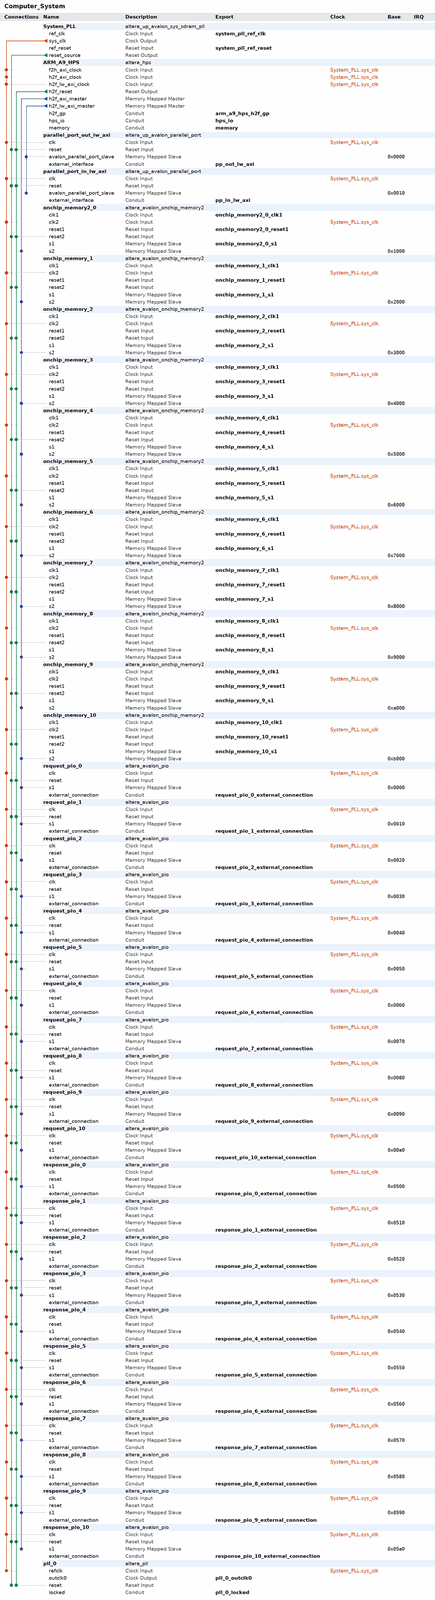
[diagram p0: system contents, whole]
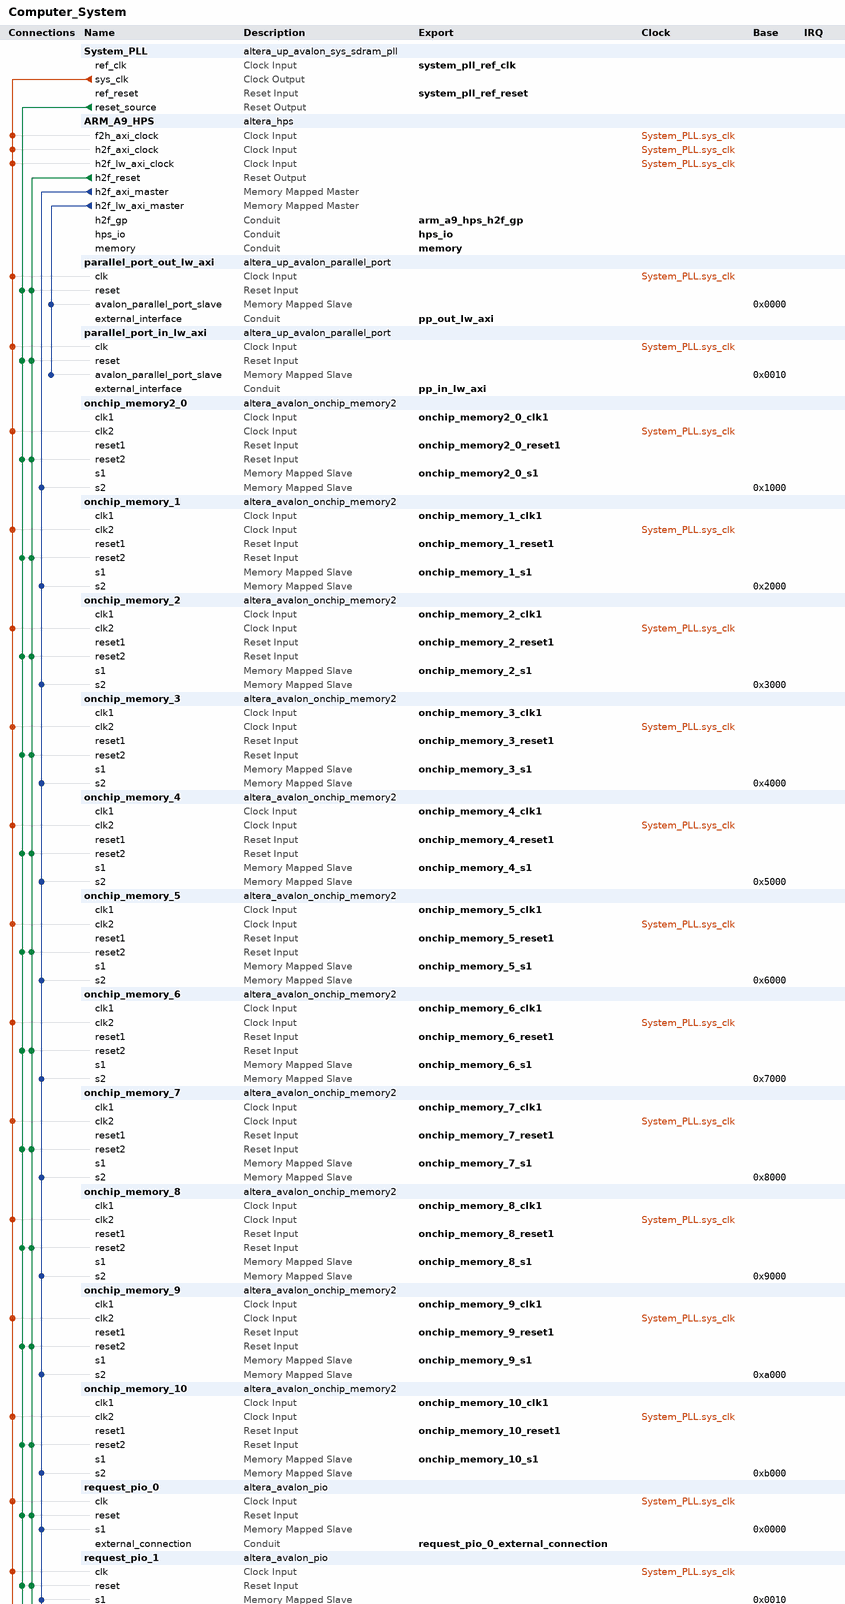
[diagram p1: system contents, upper part]
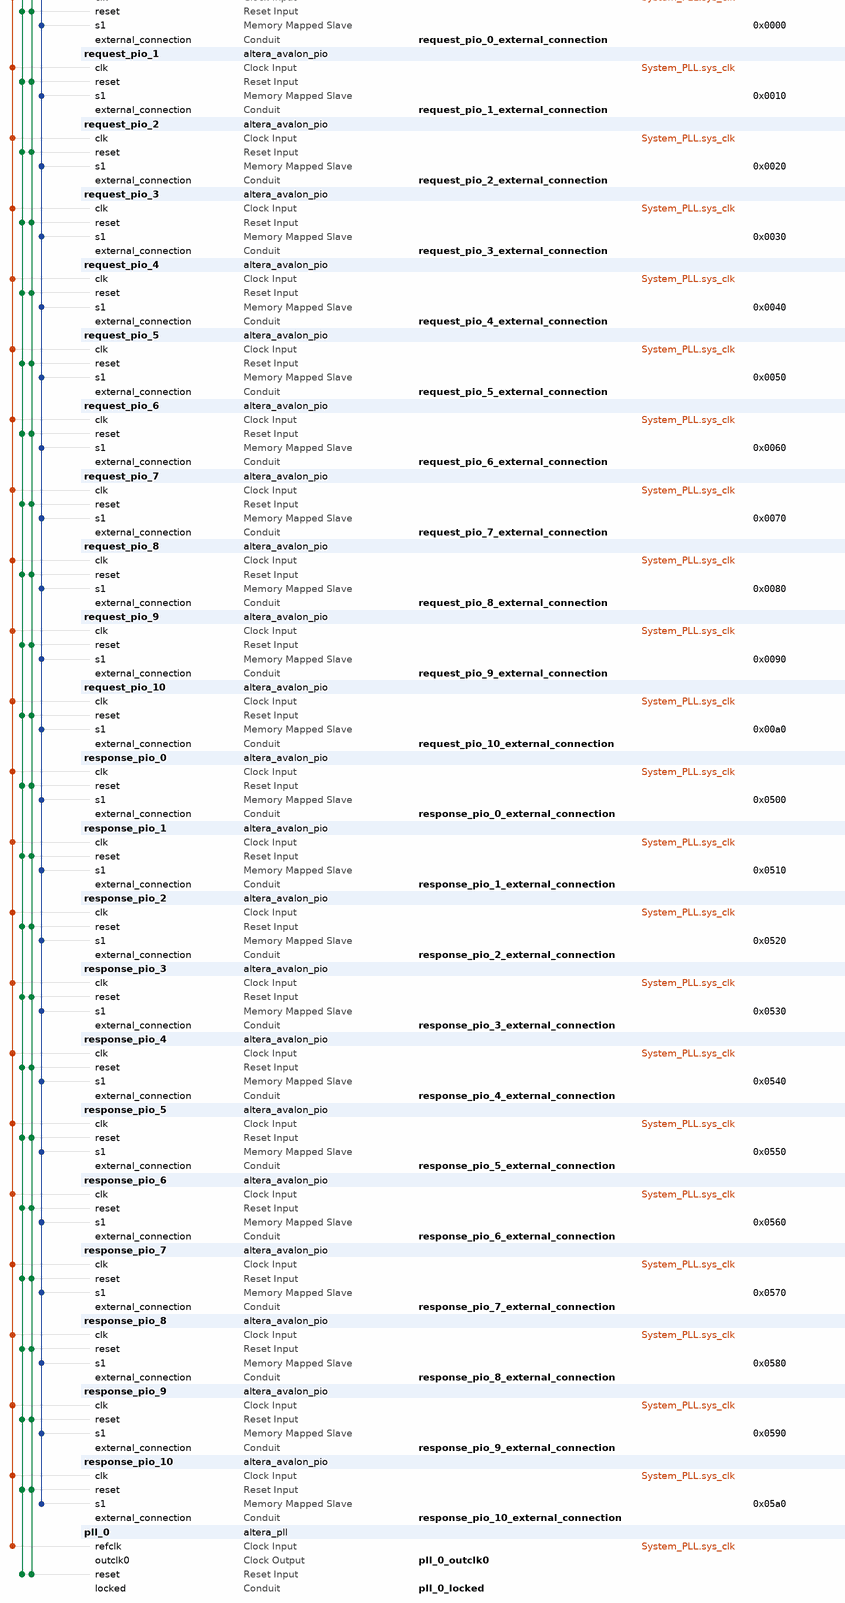
[diagram p2: system contents, lower part]
# Platform Designer (Qsys) system Computer_System, Cyclone V 5CSEMA5F31C6
# Parameters at their usual value, and those the tool derives, are not listed.
package require -exact qsys 18.1
create_system Computer_System
set_project_property DEVICE_FAMILY {Cyclone V}
set_project_property DEVICE 5CSEMA5F31C6

add_instance System_PLL altera_up_avalon_sys_sdram_pll 18.0
set_instance_parameter_value System_PLL CV_boards DE1-SoC
set_instance_parameter_value System_PLL gui_outclk 100.0
set_instance_parameter_value System_PLL gui_refclk 50.0

add_instance ARM_A9_HPS altera_hps 18.1
set_instance_parameter_value ARM_A9_HPS EMAC1_Mode RGMII
set_instance_parameter_value ARM_A9_HPS EMAC1_PinMuxing {HPS I/O Set 0}
set_instance_parameter_value ARM_A9_HPS F2SCLK_COLDRST_Enable false
set_instance_parameter_value ARM_A9_HPS F2SCLK_DBGRST_Enable false
set_instance_parameter_value ARM_A9_HPS F2SCLK_WARMRST_Enable false
set_instance_parameter_value ARM_A9_HPS F2SINTERRUPT_Enable true
set_instance_parameter_value ARM_A9_HPS F2S_Width 2
set_instance_parameter_value ARM_A9_HPS FPGA_PERIPHERAL_OUTPUT_CLOCK_FREQ_EMAC0_GTX_CLK 125
set_instance_parameter_value ARM_A9_HPS FPGA_PERIPHERAL_OUTPUT_CLOCK_FREQ_EMAC0_MD_CLK 100.0
set_instance_parameter_value ARM_A9_HPS FPGA_PERIPHERAL_OUTPUT_CLOCK_FREQ_EMAC1_GTX_CLK 125
set_instance_parameter_value ARM_A9_HPS FPGA_PERIPHERAL_OUTPUT_CLOCK_FREQ_EMAC1_MD_CLK 100.0
set_instance_parameter_value ARM_A9_HPS GP_Enable true
set_instance_parameter_value ARM_A9_HPS HPS_PROTOCOL DDR3
set_instance_parameter_value ARM_A9_HPS I2C0_Mode I2C
set_instance_parameter_value ARM_A9_HPS I2C0_PinMuxing {HPS I/O Set 0}
set_instance_parameter_value ARM_A9_HPS I2C1_Mode I2C
set_instance_parameter_value ARM_A9_HPS I2C1_PinMuxing {HPS I/O Set 0}
set_instance_parameter_value ARM_A9_HPS LWH2F_Enable true
set_instance_parameter_value ARM_A9_HPS MEM_BANKADDR_WIDTH 3
set_instance_parameter_value ARM_A9_HPS MEM_CLK_FREQ 400.0
set_instance_parameter_value ARM_A9_HPS MEM_COL_ADDR_WIDTH 10
set_instance_parameter_value ARM_A9_HPS MEM_DQ_WIDTH 32
set_instance_parameter_value ARM_A9_HPS MEM_DRV_STR RZQ/7
set_instance_parameter_value ARM_A9_HPS MEM_ROW_ADDR_WIDTH 15
set_instance_parameter_value ARM_A9_HPS MEM_RTT_NOM RZQ/4
set_instance_parameter_value ARM_A9_HPS MEM_RTT_WR RZQ/4
set_instance_parameter_value ARM_A9_HPS MEM_TCL 11
set_instance_parameter_value ARM_A9_HPS MEM_TFAW_NS 30.0
set_instance_parameter_value ARM_A9_HPS MEM_TRAS_NS 35.0
set_instance_parameter_value ARM_A9_HPS MEM_TRCD_NS 13.75
set_instance_parameter_value ARM_A9_HPS MEM_TRFC_NS 260.0
set_instance_parameter_value ARM_A9_HPS MEM_TRP_NS 13.75
set_instance_parameter_value ARM_A9_HPS MEM_VENDOR JEDEC
set_instance_parameter_value ARM_A9_HPS MEM_WTCL 8
set_instance_parameter_value ARM_A9_HPS QSPI_Mode {1 SS}
set_instance_parameter_value ARM_A9_HPS QSPI_PinMuxing {HPS I/O Set 0}
set_instance_parameter_value ARM_A9_HPS REF_CLK_FREQ 25.0
set_instance_parameter_value ARM_A9_HPS S2FCLK_USER2CLK 5
set_instance_parameter_value ARM_A9_HPS S2F_Width 3
set_instance_parameter_value ARM_A9_HPS SDIO_Mode {4-bit Data}
set_instance_parameter_value ARM_A9_HPS SDIO_PinMuxing {HPS I/O Set 0}
set_instance_parameter_value ARM_A9_HPS SPIM1_Mode {Single Slave Select}
set_instance_parameter_value ARM_A9_HPS SPIM1_PinMuxing {HPS I/O Set 0}
set_instance_parameter_value ARM_A9_HPS STM_Enable false
set_instance_parameter_value ARM_A9_HPS TIMING_BOARD_AC_SKEW 0.03
set_instance_parameter_value ARM_A9_HPS TIMING_BOARD_AC_TO_CK_SKEW 0.0
set_instance_parameter_value ARM_A9_HPS TIMING_BOARD_DQ_TO_DQS_SKEW 0.0
set_instance_parameter_value ARM_A9_HPS TIMING_BOARD_MAX_CK_DELAY 0.03
set_instance_parameter_value ARM_A9_HPS TIMING_BOARD_MAX_DQS_DELAY 0.02
set_instance_parameter_value ARM_A9_HPS TIMING_BOARD_SKEW_BETWEEN_DQS 0.08
set_instance_parameter_value ARM_A9_HPS TIMING_BOARD_SKEW_CKDQS_DIMM_MAX 0.16
set_instance_parameter_value ARM_A9_HPS TIMING_BOARD_SKEW_CKDQS_DIMM_MIN 0.09
set_instance_parameter_value ARM_A9_HPS TIMING_BOARD_SKEW_WITHIN_DQS 0.01
set_instance_parameter_value ARM_A9_HPS TIMING_TDH 65
set_instance_parameter_value ARM_A9_HPS TIMING_TDQSCK 255
set_instance_parameter_value ARM_A9_HPS TIMING_TDQSQ 125
set_instance_parameter_value ARM_A9_HPS TIMING_TDS 30
set_instance_parameter_value ARM_A9_HPS TIMING_TIH 140
set_instance_parameter_value ARM_A9_HPS TIMING_TIS 180
set_instance_parameter_value ARM_A9_HPS TIMING_TQSH 0.4
set_instance_parameter_value ARM_A9_HPS UART0_Mode {No Flow Control}
set_instance_parameter_value ARM_A9_HPS UART0_PinMuxing {HPS I/O Set 0}
set_instance_parameter_value ARM_A9_HPS USB1_Mode SDR
set_instance_parameter_value ARM_A9_HPS USB1_PinMuxing {HPS I/O Set 0}
set_instance_parameter_value ARM_A9_HPS desired_cfg_clk_mhz 100.0
set_instance_parameter_value ARM_A9_HPS desired_qspi_clk_mhz 400.0

add_instance parallel_port_out_lw_axi altera_up_avalon_parallel_port 18.0
set_instance_parameter_value parallel_port_out_lw_axi board DE2-115
set_instance_parameter_value parallel_port_out_lw_axi capture false
set_instance_parameter_value parallel_port_out_lw_axi custom_port true
set_instance_parameter_value parallel_port_out_lw_axi edge Rising
set_instance_parameter_value parallel_port_out_lw_axi irq false
set_instance_parameter_value parallel_port_out_lw_axi preset Pushbuttons

add_instance parallel_port_in_lw_axi altera_up_avalon_parallel_port 18.0
set_instance_parameter_value parallel_port_in_lw_axi board DE2-115
set_instance_parameter_value parallel_port_in_lw_axi capture false
set_instance_parameter_value parallel_port_in_lw_axi custom_port true
set_instance_parameter_value parallel_port_in_lw_axi edge Rising
set_instance_parameter_value parallel_port_in_lw_axi irq false
set_instance_parameter_value parallel_port_in_lw_axi preset Pushbuttons

add_instance onchip_memory2_0 altera_avalon_onchip_memory2 18.1
set_instance_parameter_value onchip_memory2_0 blockType M10K
set_instance_parameter_value onchip_memory2_0 dataWidth 16
set_instance_parameter_value onchip_memory2_0 dualPort true
set_instance_parameter_value onchip_memory2_0 initMemContent false
set_instance_parameter_value onchip_memory2_0 initializationFileName onchip_mem.hex
set_instance_parameter_value onchip_memory2_0 memorySize 2048
set_instance_parameter_value onchip_memory2_0 resetrequest_enabled false

add_instance onchip_memory_1 altera_avalon_onchip_memory2 18.1
set_instance_parameter_value onchip_memory_1 blockType M10K
set_instance_parameter_value onchip_memory_1 dataWidth 16
set_instance_parameter_value onchip_memory_1 dualPort true
set_instance_parameter_value onchip_memory_1 initMemContent false
set_instance_parameter_value onchip_memory_1 initializationFileName onchip_mem.hex
set_instance_parameter_value onchip_memory_1 memorySize 2048
set_instance_parameter_value onchip_memory_1 resetrequest_enabled false

add_instance onchip_memory_2 altera_avalon_onchip_memory2 18.1
set_instance_parameter_value onchip_memory_2 blockType M10K
set_instance_parameter_value onchip_memory_2 dataWidth 16
set_instance_parameter_value onchip_memory_2 dualPort true
set_instance_parameter_value onchip_memory_2 initMemContent false
set_instance_parameter_value onchip_memory_2 initializationFileName onchip_mem.hex
set_instance_parameter_value onchip_memory_2 memorySize 2048
set_instance_parameter_value onchip_memory_2 resetrequest_enabled false

add_instance onchip_memory_3 altera_avalon_onchip_memory2 18.1
set_instance_parameter_value onchip_memory_3 blockType M10K
set_instance_parameter_value onchip_memory_3 dataWidth 16
set_instance_parameter_value onchip_memory_3 dualPort true
set_instance_parameter_value onchip_memory_3 initMemContent false
set_instance_parameter_value onchip_memory_3 initializationFileName onchip_mem.hex
set_instance_parameter_value onchip_memory_3 memorySize 2048
set_instance_parameter_value onchip_memory_3 resetrequest_enabled false

add_instance onchip_memory_4 altera_avalon_onchip_memory2 18.1
set_instance_parameter_value onchip_memory_4 blockType M10K
set_instance_parameter_value onchip_memory_4 dataWidth 16
set_instance_parameter_value onchip_memory_4 dualPort true
set_instance_parameter_value onchip_memory_4 initMemContent false
set_instance_parameter_value onchip_memory_4 initializationFileName onchip_mem.hex
set_instance_parameter_value onchip_memory_4 memorySize 2048
set_instance_parameter_value onchip_memory_4 resetrequest_enabled false

add_instance onchip_memory_5 altera_avalon_onchip_memory2 18.1
set_instance_parameter_value onchip_memory_5 blockType M10K
set_instance_parameter_value onchip_memory_5 dataWidth 16
set_instance_parameter_value onchip_memory_5 dualPort true
set_instance_parameter_value onchip_memory_5 initMemContent false
set_instance_parameter_value onchip_memory_5 initializationFileName onchip_mem.hex
set_instance_parameter_value onchip_memory_5 memorySize 2048
set_instance_parameter_value onchip_memory_5 resetrequest_enabled false

add_instance onchip_memory_6 altera_avalon_onchip_memory2 18.1
set_instance_parameter_value onchip_memory_6 blockType M10K
set_instance_parameter_value onchip_memory_6 dataWidth 16
set_instance_parameter_value onchip_memory_6 dualPort true
set_instance_parameter_value onchip_memory_6 initMemContent false
set_instance_parameter_value onchip_memory_6 initializationFileName onchip_mem.hex
set_instance_parameter_value onchip_memory_6 memorySize 2048
set_instance_parameter_value onchip_memory_6 resetrequest_enabled false

add_instance onchip_memory_7 altera_avalon_onchip_memory2 18.1
set_instance_parameter_value onchip_memory_7 blockType M10K
set_instance_parameter_value onchip_memory_7 dataWidth 16
set_instance_parameter_value onchip_memory_7 dualPort true
set_instance_parameter_value onchip_memory_7 initMemContent false
set_instance_parameter_value onchip_memory_7 initializationFileName onchip_mem.hex
set_instance_parameter_value onchip_memory_7 memorySize 2048
set_instance_parameter_value onchip_memory_7 resetrequest_enabled false

add_instance onchip_memory_8 altera_avalon_onchip_memory2 18.1
set_instance_parameter_value onchip_memory_8 blockType M10K
set_instance_parameter_value onchip_memory_8 dataWidth 16
set_instance_parameter_value onchip_memory_8 dualPort true
set_instance_parameter_value onchip_memory_8 initMemContent false
set_instance_parameter_value onchip_memory_8 initializationFileName onchip_mem.hex
set_instance_parameter_value onchip_memory_8 memorySize 2048
set_instance_parameter_value onchip_memory_8 resetrequest_enabled false

add_instance onchip_memory_9 altera_avalon_onchip_memory2 18.1
set_instance_parameter_value onchip_memory_9 blockType M10K
set_instance_parameter_value onchip_memory_9 dataWidth 16
set_instance_parameter_value onchip_memory_9 dualPort true
set_instance_parameter_value onchip_memory_9 initMemContent false
set_instance_parameter_value onchip_memory_9 initializationFileName onchip_mem.hex
set_instance_parameter_value onchip_memory_9 memorySize 2048
set_instance_parameter_value onchip_memory_9 resetrequest_enabled false

add_instance onchip_memory_10 altera_avalon_onchip_memory2 18.1
set_instance_parameter_value onchip_memory_10 blockType M10K
set_instance_parameter_value onchip_memory_10 dataWidth 16
set_instance_parameter_value onchip_memory_10 dualPort true
set_instance_parameter_value onchip_memory_10 initMemContent false
set_instance_parameter_value onchip_memory_10 initializationFileName onchip_mem.hex
set_instance_parameter_value onchip_memory_10 memorySize 2048
set_instance_parameter_value onchip_memory_10 resetrequest_enabled false

add_instance request_pio_0 altera_avalon_pio 18.1
set_instance_parameter_value request_pio_0 direction Output
set_instance_parameter_value request_pio_0 width 1

add_instance request_pio_1 altera_avalon_pio 18.1
set_instance_parameter_value request_pio_1 direction Output
set_instance_parameter_value request_pio_1 width 1

add_instance request_pio_2 altera_avalon_pio 18.1
set_instance_parameter_value request_pio_2 direction Output
set_instance_parameter_value request_pio_2 width 1

add_instance request_pio_3 altera_avalon_pio 18.1
set_instance_parameter_value request_pio_3 direction Output
set_instance_parameter_value request_pio_3 width 1

add_instance request_pio_4 altera_avalon_pio 18.1
set_instance_parameter_value request_pio_4 direction Output
set_instance_parameter_value request_pio_4 width 1

add_instance request_pio_5 altera_avalon_pio 18.1
set_instance_parameter_value request_pio_5 direction Output
set_instance_parameter_value request_pio_5 width 1

add_instance request_pio_6 altera_avalon_pio 18.1
set_instance_parameter_value request_pio_6 direction Output
set_instance_parameter_value request_pio_6 width 1

add_instance request_pio_7 altera_avalon_pio 18.1
set_instance_parameter_value request_pio_7 direction Output
set_instance_parameter_value request_pio_7 width 1

add_instance request_pio_8 altera_avalon_pio 18.1
set_instance_parameter_value request_pio_8 direction Output
set_instance_parameter_value request_pio_8 width 1

add_instance request_pio_9 altera_avalon_pio 18.1
set_instance_parameter_value request_pio_9 direction Output
set_instance_parameter_value request_pio_9 width 1

add_instance request_pio_10 altera_avalon_pio 18.1
set_instance_parameter_value request_pio_10 direction Output
set_instance_parameter_value request_pio_10 width 1

add_instance response_pio_0 altera_avalon_pio 18.1
set_instance_parameter_value response_pio_0 direction Input
set_instance_parameter_value response_pio_0 width 1

add_instance response_pio_1 altera_avalon_pio 18.1
set_instance_parameter_value response_pio_1 direction Input
set_instance_parameter_value response_pio_1 width 1

add_instance response_pio_2 altera_avalon_pio 18.1
set_instance_parameter_value response_pio_2 direction Input
set_instance_parameter_value response_pio_2 width 1

add_instance response_pio_3 altera_avalon_pio 18.1
set_instance_parameter_value response_pio_3 direction Input
set_instance_parameter_value response_pio_3 width 1

add_instance response_pio_4 altera_avalon_pio 18.1
set_instance_parameter_value response_pio_4 direction Input
set_instance_parameter_value response_pio_4 width 1

add_instance response_pio_5 altera_avalon_pio 18.1
set_instance_parameter_value response_pio_5 direction Input
set_instance_parameter_value response_pio_5 width 1

add_instance response_pio_6 altera_avalon_pio 18.1
set_instance_parameter_value response_pio_6 direction Input
set_instance_parameter_value response_pio_6 width 1

add_instance response_pio_7 altera_avalon_pio 18.1
set_instance_parameter_value response_pio_7 direction Input
set_instance_parameter_value response_pio_7 width 1

add_instance response_pio_8 altera_avalon_pio 18.1
set_instance_parameter_value response_pio_8 direction Input
set_instance_parameter_value response_pio_8 width 1

add_instance response_pio_9 altera_avalon_pio 18.1
set_instance_parameter_value response_pio_9 direction Input
set_instance_parameter_value response_pio_9 width 1

add_instance response_pio_10 altera_avalon_pio 18.1
set_instance_parameter_value response_pio_10 direction Input
set_instance_parameter_value response_pio_10 width 1

add_instance pll_0 altera_pll 18.1
set_instance_parameter_value pll_0 gui_device_speed_grade 1
set_instance_parameter_value pll_0 gui_number_of_clocks 1
set_instance_parameter_value pll_0 gui_operation_mode direct
set_instance_parameter_value pll_0 gui_output_clock_frequency0 100.0
set_instance_parameter_value pll_0 gui_pll_mode {Integer-N PLL}
set_instance_parameter_value pll_0 gui_reference_clock_frequency 100.0
set_instance_parameter_value pll_0 gui_use_locked true

# connections
add_connection System_PLL.sys_clk ARM_A9_HPS.f2h_axi_clock clock
add_connection System_PLL.sys_clk ARM_A9_HPS.h2f_axi_clock clock
add_connection System_PLL.sys_clk ARM_A9_HPS.h2f_lw_axi_clock clock
add_connection System_PLL.sys_clk onchip_memory2_0.clk2 clock
add_connection System_PLL.sys_clk onchip_memory_1.clk2 clock
add_connection System_PLL.sys_clk onchip_memory_2.clk2 clock
add_connection System_PLL.sys_clk onchip_memory_3.clk2 clock
add_connection System_PLL.sys_clk onchip_memory_4.clk2 clock
add_connection System_PLL.sys_clk onchip_memory_5.clk2 clock
add_connection System_PLL.sys_clk onchip_memory_6.clk2 clock
add_connection System_PLL.sys_clk onchip_memory_7.clk2 clock
add_connection System_PLL.sys_clk onchip_memory_8.clk2 clock
add_connection System_PLL.sys_clk onchip_memory_9.clk2 clock
add_connection System_PLL.sys_clk onchip_memory_10.clk2 clock
add_connection System_PLL.sys_clk parallel_port_in_lw_axi.clk clock
add_connection System_PLL.sys_clk parallel_port_out_lw_axi.clk clock
add_connection System_PLL.sys_clk pll_0.refclk clock
add_connection System_PLL.sys_clk request_pio_0.clk clock
add_connection System_PLL.sys_clk request_pio_1.clk clock
add_connection System_PLL.sys_clk request_pio_2.clk clock
add_connection System_PLL.sys_clk request_pio_3.clk clock
add_connection System_PLL.sys_clk request_pio_4.clk clock
add_connection System_PLL.sys_clk request_pio_5.clk clock
add_connection System_PLL.sys_clk request_pio_6.clk clock
add_connection System_PLL.sys_clk request_pio_7.clk clock
add_connection System_PLL.sys_clk request_pio_8.clk clock
add_connection System_PLL.sys_clk request_pio_9.clk clock
add_connection System_PLL.sys_clk request_pio_10.clk clock
add_connection System_PLL.sys_clk response_pio_0.clk clock
add_connection System_PLL.sys_clk response_pio_1.clk clock
add_connection System_PLL.sys_clk response_pio_2.clk clock
add_connection System_PLL.sys_clk response_pio_3.clk clock
add_connection System_PLL.sys_clk response_pio_4.clk clock
add_connection System_PLL.sys_clk response_pio_5.clk clock
add_connection System_PLL.sys_clk response_pio_6.clk clock
add_connection System_PLL.sys_clk response_pio_7.clk clock
add_connection System_PLL.sys_clk response_pio_8.clk clock
add_connection System_PLL.sys_clk response_pio_9.clk clock
add_connection System_PLL.sys_clk response_pio_10.clk clock
add_connection ARM_A9_HPS.h2f_reset onchip_memory2_0.reset2 reset
add_connection ARM_A9_HPS.h2f_reset onchip_memory_1.reset2 reset
add_connection ARM_A9_HPS.h2f_reset onchip_memory_2.reset2 reset
add_connection ARM_A9_HPS.h2f_reset onchip_memory_3.reset2 reset
add_connection ARM_A9_HPS.h2f_reset onchip_memory_4.reset2 reset
add_connection ARM_A9_HPS.h2f_reset onchip_memory_5.reset2 reset
add_connection ARM_A9_HPS.h2f_reset onchip_memory_6.reset2 reset
add_connection ARM_A9_HPS.h2f_reset onchip_memory_7.reset2 reset
add_connection ARM_A9_HPS.h2f_reset onchip_memory_8.reset2 reset
add_connection ARM_A9_HPS.h2f_reset onchip_memory_9.reset2 reset
add_connection ARM_A9_HPS.h2f_reset onchip_memory_10.reset2 reset
add_connection ARM_A9_HPS.h2f_reset parallel_port_in_lw_axi.reset reset
add_connection ARM_A9_HPS.h2f_reset parallel_port_out_lw_axi.reset reset
add_connection ARM_A9_HPS.h2f_reset pll_0.reset reset
add_connection ARM_A9_HPS.h2f_reset request_pio_0.reset reset
add_connection ARM_A9_HPS.h2f_reset request_pio_1.reset reset
add_connection ARM_A9_HPS.h2f_reset request_pio_2.reset reset
add_connection ARM_A9_HPS.h2f_reset request_pio_3.reset reset
add_connection ARM_A9_HPS.h2f_reset request_pio_4.reset reset
add_connection ARM_A9_HPS.h2f_reset request_pio_5.reset reset
add_connection ARM_A9_HPS.h2f_reset request_pio_6.reset reset
add_connection ARM_A9_HPS.h2f_reset request_pio_7.reset reset
add_connection ARM_A9_HPS.h2f_reset request_pio_8.reset reset
add_connection ARM_A9_HPS.h2f_reset request_pio_9.reset reset
add_connection ARM_A9_HPS.h2f_reset request_pio_10.reset reset
add_connection ARM_A9_HPS.h2f_reset response_pio_0.reset reset
add_connection ARM_A9_HPS.h2f_reset response_pio_1.reset reset
add_connection ARM_A9_HPS.h2f_reset response_pio_2.reset reset
add_connection ARM_A9_HPS.h2f_reset response_pio_3.reset reset
add_connection ARM_A9_HPS.h2f_reset response_pio_4.reset reset
add_connection ARM_A9_HPS.h2f_reset response_pio_5.reset reset
add_connection ARM_A9_HPS.h2f_reset response_pio_6.reset reset
add_connection ARM_A9_HPS.h2f_reset response_pio_7.reset reset
add_connection ARM_A9_HPS.h2f_reset response_pio_8.reset reset
add_connection ARM_A9_HPS.h2f_reset response_pio_9.reset reset
add_connection ARM_A9_HPS.h2f_reset response_pio_10.reset reset
add_connection System_PLL.reset_source onchip_memory2_0.reset2 reset
add_connection System_PLL.reset_source onchip_memory_1.reset2 reset
add_connection System_PLL.reset_source onchip_memory_2.reset2 reset
add_connection System_PLL.reset_source onchip_memory_3.reset2 reset
add_connection System_PLL.reset_source onchip_memory_4.reset2 reset
add_connection System_PLL.reset_source onchip_memory_5.reset2 reset
add_connection System_PLL.reset_source onchip_memory_6.reset2 reset
add_connection System_PLL.reset_source onchip_memory_7.reset2 reset
add_connection System_PLL.reset_source onchip_memory_8.reset2 reset
add_connection System_PLL.reset_source onchip_memory_9.reset2 reset
add_connection System_PLL.reset_source onchip_memory_10.reset2 reset
add_connection System_PLL.reset_source parallel_port_in_lw_axi.reset reset
add_connection System_PLL.reset_source parallel_port_out_lw_axi.reset reset
add_connection System_PLL.reset_source pll_0.reset reset
add_connection System_PLL.reset_source request_pio_0.reset reset
add_connection System_PLL.reset_source request_pio_1.reset reset
add_connection System_PLL.reset_source request_pio_2.reset reset
add_connection System_PLL.reset_source request_pio_3.reset reset
add_connection System_PLL.reset_source request_pio_4.reset reset
add_connection System_PLL.reset_source request_pio_5.reset reset
add_connection System_PLL.reset_source request_pio_6.reset reset
add_connection System_PLL.reset_source request_pio_7.reset reset
add_connection System_PLL.reset_source request_pio_8.reset reset
add_connection System_PLL.reset_source request_pio_9.reset reset
add_connection System_PLL.reset_source request_pio_10.reset reset
add_connection System_PLL.reset_source response_pio_0.reset reset
add_connection System_PLL.reset_source response_pio_1.reset reset
add_connection System_PLL.reset_source response_pio_2.reset reset
add_connection System_PLL.reset_source response_pio_3.reset reset
add_connection System_PLL.reset_source response_pio_4.reset reset
add_connection System_PLL.reset_source response_pio_5.reset reset
add_connection System_PLL.reset_source response_pio_6.reset reset
add_connection System_PLL.reset_source response_pio_7.reset reset
add_connection System_PLL.reset_source response_pio_8.reset reset
add_connection System_PLL.reset_source response_pio_9.reset reset
add_connection System_PLL.reset_source response_pio_10.reset reset
add_connection ARM_A9_HPS.h2f_axi_master onchip_memory2_0.s2 avalon
set_connection_parameter_value ARM_A9_HPS.h2f_axi_master/onchip_memory2_0.s2 baseAddress 0x1000
add_connection ARM_A9_HPS.h2f_axi_master onchip_memory_1.s2 avalon
set_connection_parameter_value ARM_A9_HPS.h2f_axi_master/onchip_memory_1.s2 baseAddress 0x2000
add_connection ARM_A9_HPS.h2f_axi_master onchip_memory_2.s2 avalon
set_connection_parameter_value ARM_A9_HPS.h2f_axi_master/onchip_memory_2.s2 baseAddress 0x3000
add_connection ARM_A9_HPS.h2f_axi_master onchip_memory_3.s2 avalon
set_connection_parameter_value ARM_A9_HPS.h2f_axi_master/onchip_memory_3.s2 baseAddress 0x4000
add_connection ARM_A9_HPS.h2f_axi_master onchip_memory_4.s2 avalon
set_connection_parameter_value ARM_A9_HPS.h2f_axi_master/onchip_memory_4.s2 baseAddress 0x5000
add_connection ARM_A9_HPS.h2f_axi_master onchip_memory_5.s2 avalon
set_connection_parameter_value ARM_A9_HPS.h2f_axi_master/onchip_memory_5.s2 baseAddress 0x6000
add_connection ARM_A9_HPS.h2f_axi_master onchip_memory_6.s2 avalon
set_connection_parameter_value ARM_A9_HPS.h2f_axi_master/onchip_memory_6.s2 baseAddress 0x7000
add_connection ARM_A9_HPS.h2f_axi_master onchip_memory_7.s2 avalon
set_connection_parameter_value ARM_A9_HPS.h2f_axi_master/onchip_memory_7.s2 baseAddress 0x8000
add_connection ARM_A9_HPS.h2f_axi_master onchip_memory_8.s2 avalon
set_connection_parameter_value ARM_A9_HPS.h2f_axi_master/onchip_memory_8.s2 baseAddress 0x9000
add_connection ARM_A9_HPS.h2f_axi_master onchip_memory_9.s2 avalon
set_connection_parameter_value ARM_A9_HPS.h2f_axi_master/onchip_memory_9.s2 baseAddress 0xa000
add_connection ARM_A9_HPS.h2f_axi_master onchip_memory_10.s2 avalon
set_connection_parameter_value ARM_A9_HPS.h2f_axi_master/onchip_memory_10.s2 baseAddress 0xb000
add_connection ARM_A9_HPS.h2f_axi_master request_pio_0.s1 avalon
set_connection_parameter_value ARM_A9_HPS.h2f_axi_master/request_pio_0.s1 baseAddress 0x0000
add_connection ARM_A9_HPS.h2f_axi_master request_pio_1.s1 avalon
set_connection_parameter_value ARM_A9_HPS.h2f_axi_master/request_pio_1.s1 baseAddress 0x0010
add_connection ARM_A9_HPS.h2f_axi_master request_pio_2.s1 avalon
set_connection_parameter_value ARM_A9_HPS.h2f_axi_master/request_pio_2.s1 baseAddress 0x0020
add_connection ARM_A9_HPS.h2f_axi_master request_pio_3.s1 avalon
set_connection_parameter_value ARM_A9_HPS.h2f_axi_master/request_pio_3.s1 baseAddress 0x0030
add_connection ARM_A9_HPS.h2f_axi_master request_pio_4.s1 avalon
set_connection_parameter_value ARM_A9_HPS.h2f_axi_master/request_pio_4.s1 baseAddress 0x0040
add_connection ARM_A9_HPS.h2f_axi_master request_pio_5.s1 avalon
set_connection_parameter_value ARM_A9_HPS.h2f_axi_master/request_pio_5.s1 baseAddress 0x0050
add_connection ARM_A9_HPS.h2f_axi_master request_pio_6.s1 avalon
set_connection_parameter_value ARM_A9_HPS.h2f_axi_master/request_pio_6.s1 baseAddress 0x0060
add_connection ARM_A9_HPS.h2f_axi_master request_pio_7.s1 avalon
set_connection_parameter_value ARM_A9_HPS.h2f_axi_master/request_pio_7.s1 baseAddress 0x0070
add_connection ARM_A9_HPS.h2f_axi_master request_pio_8.s1 avalon
set_connection_parameter_value ARM_A9_HPS.h2f_axi_master/request_pio_8.s1 baseAddress 0x0080
add_connection ARM_A9_HPS.h2f_axi_master request_pio_9.s1 avalon
set_connection_parameter_value ARM_A9_HPS.h2f_axi_master/request_pio_9.s1 baseAddress 0x0090
add_connection ARM_A9_HPS.h2f_axi_master request_pio_10.s1 avalon
set_connection_parameter_value ARM_A9_HPS.h2f_axi_master/request_pio_10.s1 baseAddress 0x00a0
add_connection ARM_A9_HPS.h2f_axi_master response_pio_0.s1 avalon
set_connection_parameter_value ARM_A9_HPS.h2f_axi_master/response_pio_0.s1 baseAddress 0x0500
add_connection ARM_A9_HPS.h2f_axi_master response_pio_1.s1 avalon
set_connection_parameter_value ARM_A9_HPS.h2f_axi_master/response_pio_1.s1 baseAddress 0x0510
add_connection ARM_A9_HPS.h2f_axi_master response_pio_2.s1 avalon
set_connection_parameter_value ARM_A9_HPS.h2f_axi_master/response_pio_2.s1 baseAddress 0x0520
add_connection ARM_A9_HPS.h2f_axi_master response_pio_3.s1 avalon
set_connection_parameter_value ARM_A9_HPS.h2f_axi_master/response_pio_3.s1 baseAddress 0x0530
add_connection ARM_A9_HPS.h2f_axi_master response_pio_4.s1 avalon
set_connection_parameter_value ARM_A9_HPS.h2f_axi_master/response_pio_4.s1 baseAddress 0x0540
add_connection ARM_A9_HPS.h2f_axi_master response_pio_5.s1 avalon
set_connection_parameter_value ARM_A9_HPS.h2f_axi_master/response_pio_5.s1 baseAddress 0x0550
add_connection ARM_A9_HPS.h2f_axi_master response_pio_6.s1 avalon
set_connection_parameter_value ARM_A9_HPS.h2f_axi_master/response_pio_6.s1 baseAddress 0x0560
add_connection ARM_A9_HPS.h2f_axi_master response_pio_7.s1 avalon
set_connection_parameter_value ARM_A9_HPS.h2f_axi_master/response_pio_7.s1 baseAddress 0x0570
add_connection ARM_A9_HPS.h2f_axi_master response_pio_8.s1 avalon
set_connection_parameter_value ARM_A9_HPS.h2f_axi_master/response_pio_8.s1 baseAddress 0x0580
add_connection ARM_A9_HPS.h2f_axi_master response_pio_9.s1 avalon
set_connection_parameter_value ARM_A9_HPS.h2f_axi_master/response_pio_9.s1 baseAddress 0x0590
add_connection ARM_A9_HPS.h2f_axi_master response_pio_10.s1 avalon
set_connection_parameter_value ARM_A9_HPS.h2f_axi_master/response_pio_10.s1 baseAddress 0x05a0
add_connection ARM_A9_HPS.h2f_lw_axi_master parallel_port_in_lw_axi.avalon_parallel_port_slave avalon
set_connection_parameter_value ARM_A9_HPS.h2f_lw_axi_master/parallel_port_in_lw_axi.avalon_parallel_port_slave baseAddress 0x0010
add_connection ARM_A9_HPS.h2f_lw_axi_master parallel_port_out_lw_axi.avalon_parallel_port_slave avalon
set_connection_parameter_value ARM_A9_HPS.h2f_lw_axi_master/parallel_port_out_lw_axi.avalon_parallel_port_slave baseAddress 0x0000

# exported interfaces
add_interface arm_a9_hps_h2f_gp conduit end
set_interface_property arm_a9_hps_h2f_gp EXPORT_OF ARM_A9_HPS.h2f_gp
add_interface hps_io conduit end
set_interface_property hps_io EXPORT_OF ARM_A9_HPS.hps_io
add_interface memory conduit end
set_interface_property memory EXPORT_OF ARM_A9_HPS.memory
add_interface onchip_memory2_0_clk1 clock sink
set_interface_property onchip_memory2_0_clk1 EXPORT_OF onchip_memory2_0.clk1
add_interface onchip_memory2_0_reset1 reset sink
set_interface_property onchip_memory2_0_reset1 EXPORT_OF onchip_memory2_0.reset1
add_interface onchip_memory2_0_s1 avalon slave
set_interface_property onchip_memory2_0_s1 EXPORT_OF onchip_memory2_0.s1
add_interface onchip_memory_10_clk1 clock sink
set_interface_property onchip_memory_10_clk1 EXPORT_OF onchip_memory_10.clk1
add_interface onchip_memory_10_reset1 reset sink
set_interface_property onchip_memory_10_reset1 EXPORT_OF onchip_memory_10.reset1
add_interface onchip_memory_10_s1 avalon slave
set_interface_property onchip_memory_10_s1 EXPORT_OF onchip_memory_10.s1
add_interface onchip_memory_1_clk1 clock sink
set_interface_property onchip_memory_1_clk1 EXPORT_OF onchip_memory_1.clk1
add_interface onchip_memory_1_reset1 reset sink
set_interface_property onchip_memory_1_reset1 EXPORT_OF onchip_memory_1.reset1
add_interface onchip_memory_1_s1 avalon slave
set_interface_property onchip_memory_1_s1 EXPORT_OF onchip_memory_1.s1
add_interface onchip_memory_2_clk1 clock sink
set_interface_property onchip_memory_2_clk1 EXPORT_OF onchip_memory_2.clk1
add_interface onchip_memory_2_reset1 reset sink
set_interface_property onchip_memory_2_reset1 EXPORT_OF onchip_memory_2.reset1
add_interface onchip_memory_2_s1 avalon slave
set_interface_property onchip_memory_2_s1 EXPORT_OF onchip_memory_2.s1
add_interface onchip_memory_3_clk1 clock sink
set_interface_property onchip_memory_3_clk1 EXPORT_OF onchip_memory_3.clk1
add_interface onchip_memory_3_reset1 reset sink
set_interface_property onchip_memory_3_reset1 EXPORT_OF onchip_memory_3.reset1
add_interface onchip_memory_3_s1 avalon slave
set_interface_property onchip_memory_3_s1 EXPORT_OF onchip_memory_3.s1
add_interface onchip_memory_4_clk1 clock sink
set_interface_property onchip_memory_4_clk1 EXPORT_OF onchip_memory_4.clk1
add_interface onchip_memory_4_reset1 reset sink
set_interface_property onchip_memory_4_reset1 EXPORT_OF onchip_memory_4.reset1
add_interface onchip_memory_4_s1 avalon slave
set_interface_property onchip_memory_4_s1 EXPORT_OF onchip_memory_4.s1
add_interface onchip_memory_5_clk1 clock sink
set_interface_property onchip_memory_5_clk1 EXPORT_OF onchip_memory_5.clk1
add_interface onchip_memory_5_reset1 reset sink
set_interface_property onchip_memory_5_reset1 EXPORT_OF onchip_memory_5.reset1
add_interface onchip_memory_5_s1 avalon slave
set_interface_property onchip_memory_5_s1 EXPORT_OF onchip_memory_5.s1
add_interface onchip_memory_6_clk1 clock sink
set_interface_property onchip_memory_6_clk1 EXPORT_OF onchip_memory_6.clk1
add_interface onchip_memory_6_reset1 reset sink
set_interface_property onchip_memory_6_reset1 EXPORT_OF onchip_memory_6.reset1
add_interface onchip_memory_6_s1 avalon slave
set_interface_property onchip_memory_6_s1 EXPORT_OF onchip_memory_6.s1
add_interface onchip_memory_7_clk1 clock sink
set_interface_property onchip_memory_7_clk1 EXPORT_OF onchip_memory_7.clk1
add_interface onchip_memory_7_reset1 reset sink
set_interface_property onchip_memory_7_reset1 EXPORT_OF onchip_memory_7.reset1
add_interface onchip_memory_7_s1 avalon slave
set_interface_property onchip_memory_7_s1 EXPORT_OF onchip_memory_7.s1
add_interface onchip_memory_8_clk1 clock sink
set_interface_property onchip_memory_8_clk1 EXPORT_OF onchip_memory_8.clk1
add_interface onchip_memory_8_reset1 reset sink
set_interface_property onchip_memory_8_reset1 EXPORT_OF onchip_memory_8.reset1
add_interface onchip_memory_8_s1 avalon slave
set_interface_property onchip_memory_8_s1 EXPORT_OF onchip_memory_8.s1
add_interface onchip_memory_9_clk1 clock sink
set_interface_property onchip_memory_9_clk1 EXPORT_OF onchip_memory_9.clk1
add_interface onchip_memory_9_reset1 reset sink
set_interface_property onchip_memory_9_reset1 EXPORT_OF onchip_memory_9.reset1
add_interface onchip_memory_9_s1 avalon slave
set_interface_property onchip_memory_9_s1 EXPORT_OF onchip_memory_9.s1
add_interface pll_0_locked conduit end
set_interface_property pll_0_locked EXPORT_OF pll_0.locked
add_interface pll_0_outclk0 clock source
set_interface_property pll_0_outclk0 EXPORT_OF pll_0.outclk0
add_interface pp_in_lw_axi conduit end
set_interface_property pp_in_lw_axi EXPORT_OF parallel_port_in_lw_axi.external_interface
add_interface pp_out_lw_axi conduit end
set_interface_property pp_out_lw_axi EXPORT_OF parallel_port_out_lw_axi.external_interface
add_interface request_pio_0_external_connection conduit end
set_interface_property request_pio_0_external_connection EXPORT_OF request_pio_0.external_connection
add_interface request_pio_10_external_connection conduit end
set_interface_property request_pio_10_external_connection EXPORT_OF request_pio_10.external_connection
add_interface request_pio_1_external_connection conduit end
set_interface_property request_pio_1_external_connection EXPORT_OF request_pio_1.external_connection
add_interface request_pio_2_external_connection conduit end
set_interface_property request_pio_2_external_connection EXPORT_OF request_pio_2.external_connection
add_interface request_pio_3_external_connection conduit end
set_interface_property request_pio_3_external_connection EXPORT_OF request_pio_3.external_connection
add_interface request_pio_4_external_connection conduit end
set_interface_property request_pio_4_external_connection EXPORT_OF request_pio_4.external_connection
add_interface request_pio_5_external_connection conduit end
set_interface_property request_pio_5_external_connection EXPORT_OF request_pio_5.external_connection
add_interface request_pio_6_external_connection conduit end
set_interface_property request_pio_6_external_connection EXPORT_OF request_pio_6.external_connection
add_interface request_pio_7_external_connection conduit end
set_interface_property request_pio_7_external_connection EXPORT_OF request_pio_7.external_connection
add_interface request_pio_8_external_connection conduit end
set_interface_property request_pio_8_external_connection EXPORT_OF request_pio_8.external_connection
add_interface request_pio_9_external_connection conduit end
set_interface_property request_pio_9_external_connection EXPORT_OF request_pio_9.external_connection
add_interface response_pio_0_external_connection conduit end
set_interface_property response_pio_0_external_connection EXPORT_OF response_pio_0.external_connection
add_interface response_pio_10_external_connection conduit end
set_interface_property response_pio_10_external_connection EXPORT_OF response_pio_10.external_connection
add_interface response_pio_1_external_connection conduit end
set_interface_property response_pio_1_external_connection EXPORT_OF response_pio_1.external_connection
add_interface response_pio_2_external_connection conduit end
set_interface_property response_pio_2_external_connection EXPORT_OF response_pio_2.external_connection
add_interface response_pio_3_external_connection conduit end
set_interface_property response_pio_3_external_connection EXPORT_OF response_pio_3.external_connection
add_interface response_pio_4_external_connection conduit end
set_interface_property response_pio_4_external_connection EXPORT_OF response_pio_4.external_connection
add_interface response_pio_5_external_connection conduit end
set_interface_property response_pio_5_external_connection EXPORT_OF response_pio_5.external_connection
add_interface response_pio_6_external_connection conduit end
set_interface_property response_pio_6_external_connection EXPORT_OF response_pio_6.external_connection
add_interface response_pio_7_external_connection conduit end
set_interface_property response_pio_7_external_connection EXPORT_OF response_pio_7.external_connection
add_interface response_pio_8_external_connection conduit end
set_interface_property response_pio_8_external_connection EXPORT_OF response_pio_8.external_connection
add_interface response_pio_9_external_connection conduit end
set_interface_property response_pio_9_external_connection EXPORT_OF response_pio_9.external_connection
add_interface system_pll_ref_clk clock sink
set_interface_property system_pll_ref_clk EXPORT_OF System_PLL.ref_clk
add_interface system_pll_ref_reset reset sink
set_interface_property system_pll_ref_reset EXPORT_OF System_PLL.ref_reset

set_interconnect_requirement {$system} qsys_mm.clockCrossingAdapter HANDSHAKE
set_interconnect_requirement {$system} qsys_mm.enableEccProtection FALSE
set_interconnect_requirement {$system} qsys_mm.insertDefaultSlave FALSE
set_interconnect_requirement {$system} qsys_mm.maxAdditionalLatency 1

save_system Computer_System.qsys
